# EAGLE schematic micromouse2018_v1 (EAGLE 9.0.1)
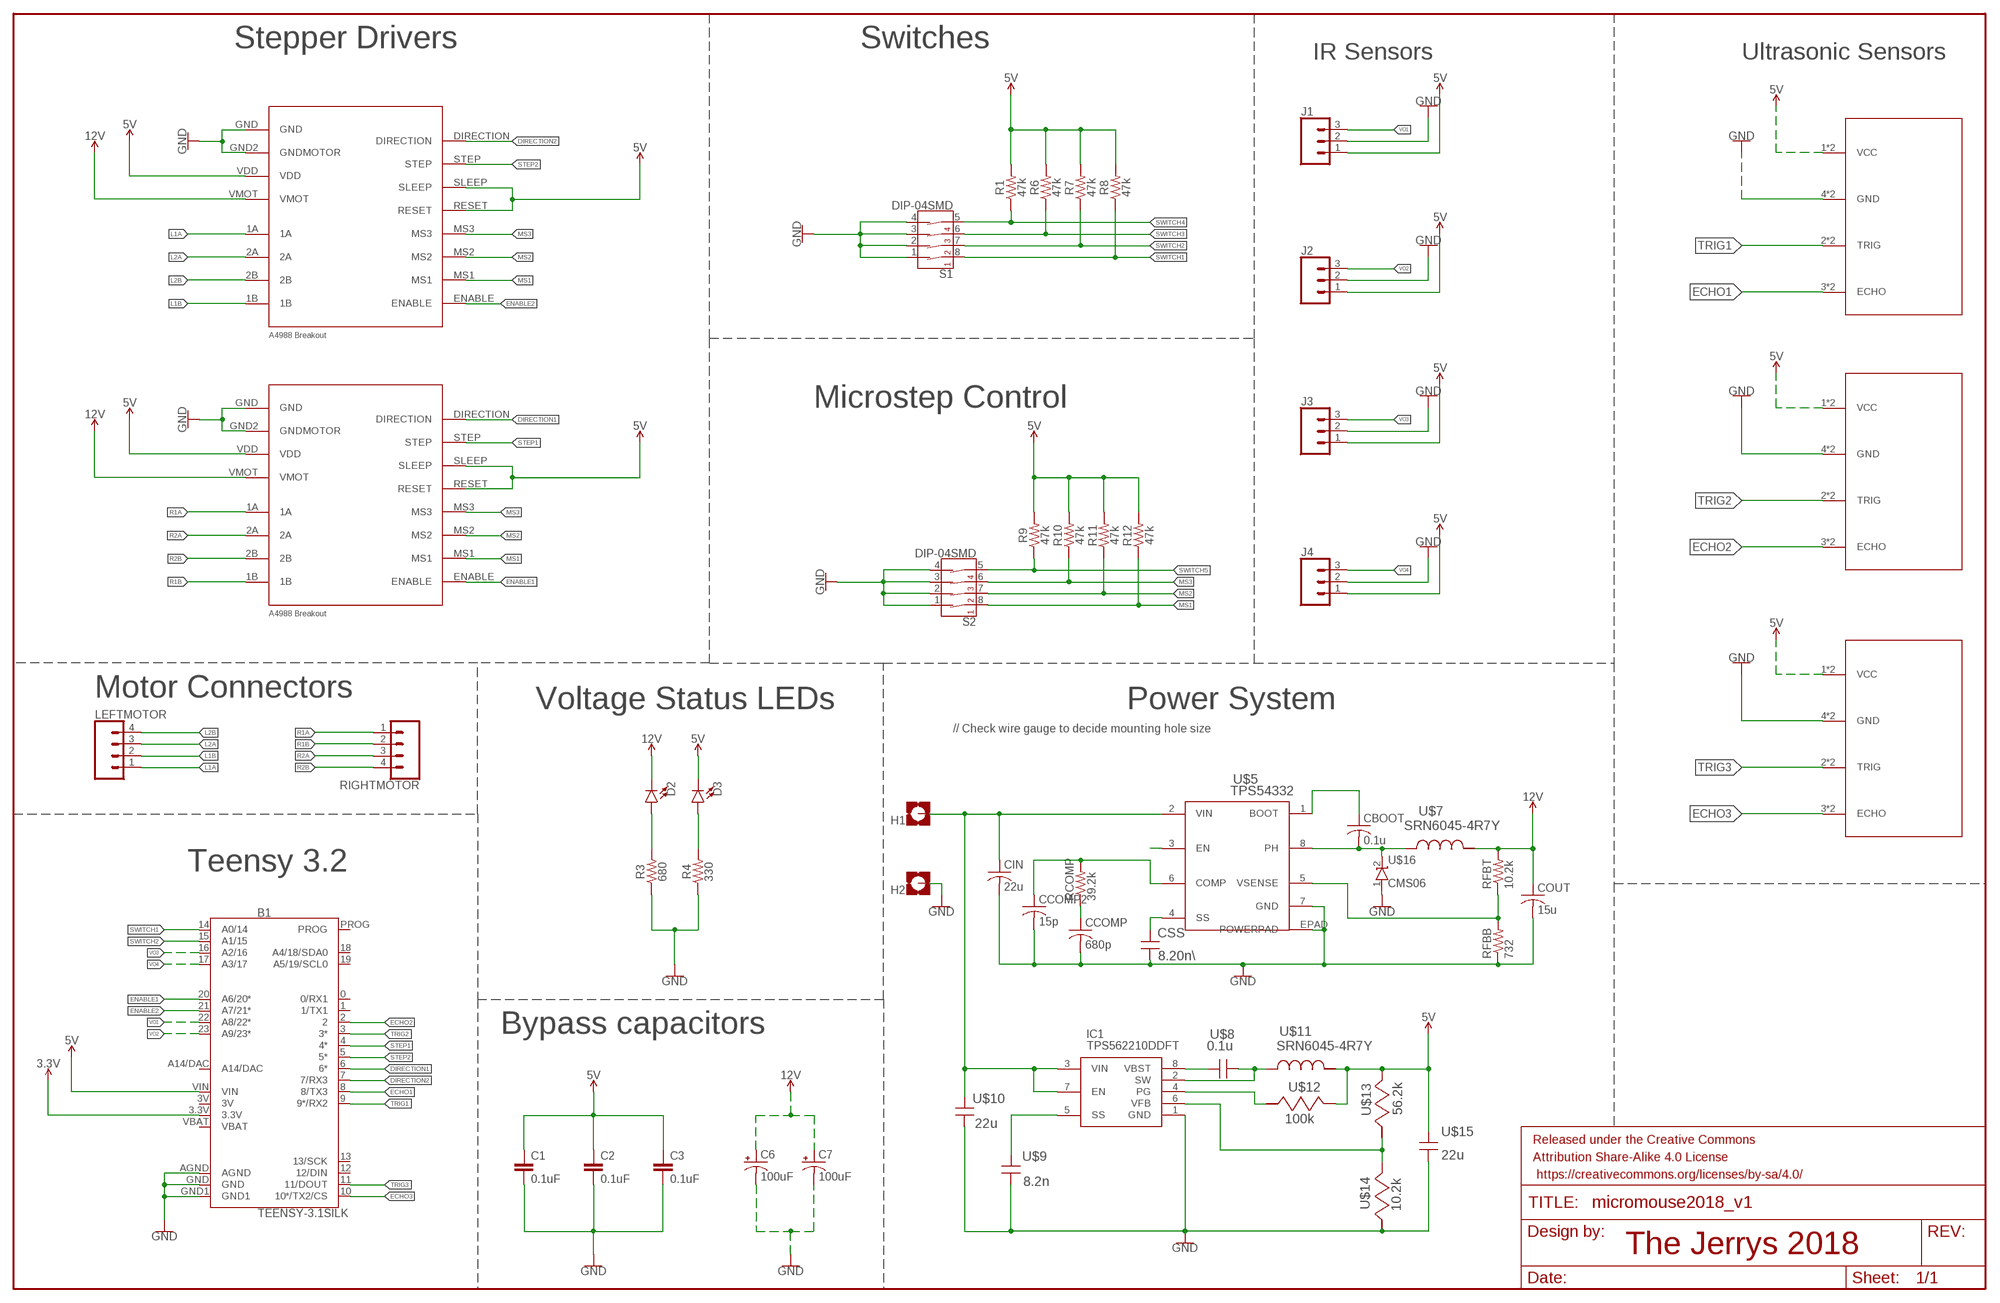
[diagram p0: schematic, sheet 1]

## Parts
B1  TEENSY-3.1SILK  [TEENSY-3.1]
C1  0.1uF  0.1UF-0603-25V-(+80/-20%)  [0603]
C2  0.1uF  0.1UF-0603-25V-(+80/-20%)  [0603]
C3  0.1uF  0.1UF-0603-25V-(+80/-20%)  [0603]
C6  100uF  100UF-POLAR-25V-20%(ELEC)  [PANASONIC_D]
C7  100uF  100UF-POLAR-25V-20%(ELEC)  [PANASONIC_D]
CBOOT  0.1u  C-USC0805  [C0805]
CCOMP  680p  C-USC0805  [C0805]
CCOMP2  15p  C-USC0805  [C0805]
CIN  22u  C-USC1210  [C1210]
COUT  15u  C-USC0805  [C0805]
CSS  8.20n\  12063A822JAT2A  [1206]
D2  LED0603  [LED-0603]
D3  LED0603  [LED-0603]
FRAME1  FRAME-LEDGER  [CREATIVE_COMMONS]
H1  MOUNT-PAD-SQUARE2.8  [2,8-PAD-SQUARE]
H2  MOUNT-PAD-SQUARE2.8  [2,8-PAD-SQUARE]
IC1  TPS562210DDFT  [SOT65P280X110-8N]
J1  CONN_03JST-PTH-VERT  [JST-3-PTH-VERT]
J2  CONN_03JST-PTH-VERT  [JST-3-PTH-VERT]
J3  CONN_03JST-PTH-VERT  [JST-3-PTH-VERT]
J4  CONN_03JST-PTH-VERT  [JST-3-PTH-VERT]
LEFTMOTOR  CONN_04LONGPADS  [1X04_LONGPADS]
R1  47k  47KOHM-0603-1/10W-1%  [0603]
R3  680  680OHM-0603-1/10W-5%  [0603]
R4  330  330OHM-0603-1/10W-1%  [0603]
R6  47k  47KOHM-0603-1/10W-1%  [0603]
R7  47k  47KOHM-0603-1/10W-1%  [0603]
R8  47k  47KOHM-0603-1/10W-1%  [0603]
R9  47k  47KOHM-0603-1/10W-1%  [0603]
R10  47k  47KOHM-0603-1/10W-1%  [0603]
R11  47k  47KOHM-0603-1/10W-1%  [0603]
R12  47k  47KOHM-0603-1/10W-1%  [0603]
RCOMP  39.2k  R-US_R0805  [R0805]
RFBB  732  R-US_R0805  [R0805]
RFBT  10.2k  R-US_R0805  [R0805]
RIGHTMOTOR  CONN_04LONGPADS  [1X04_LONGPADS]
S1  DIP-04SMD  [DIPSWITCH-04-SMD]
S2  DIP-04SMD  [DIPSWITCH-04-SMD]
U$1  A4988_BREAKOUT  [A4988_BREAKOUT]
U$2  A4988_BREAKOUT  [A4988_BREAKOUT]
U$3  ULTRASONIC  [1X04_SMD_VERTICAL_COMBO]
U$4  ULTRASONIC  [1X04_SMD_VERTICAL_COMBO]
U$5  TPS54332  [DDA8_2P13X3-M]
U$6  ULTRASONIC  [1X04_SMD_VERTICAL_COMBO]
U$7  SRN6045-4R7Y  [SRN6045]
U$8  0.1u  08053C104KAT2A  [0805]
U$9  8.2n  12063A822JAT2A  [1206]
U$10  22u  GRM32ER61E226KE15L  [1210]
U$11  SRN6045-4R7Y  [SRN6045]
U$12  100k  RR1220P-104-D  [0805]
U$13  56.2k  ERJ-6ENF5622V  [0805]
U$14  10.2k  ERJ-6ENF1022V  [0805]
U$15  22u  GRM31CR61A226KE19L  [1206_190]
U$16  CMS06  [SODFL4724X108N]

## Nets
3.3V: B1.3.3V
5V: B1.VIN C1.1 C2.1 C3.1 D3.C J1.1 J2.1 J3.1 J4.1 R1.2 R6.2 R7.2 R8.2 R9.2 R10.2 R11.2 R12.2 U$1.RESET U$1.SLEEP U$1.VDD U$2.RESET U$2.SLEEP U$2.VDD U$3.1(VCC) U$3.1-2(VCC) U$4.1(VCC) U$4.1-2(VCC) U$6.1(VCC) U$6.1-2(VCC) U$11.2 U$12.1 U$13.1 U$15.1
12V: C6.+ C7.+ COUT.1 D2.C RFBT.2 U$1.VMOT U$2.VMOT U$7.2
BOOT: IC1.2(SW) U$8.1 U$11.1
DIRECTION1: B1.6(6*) U$2.DIRECTION
DIRECTION2: B1.7(7/RX3) U$1.DIRECTION
ECHO1: B1.8(8/TX3) U$3.3(ECHO) U$3.3-2(ECHO)
ECHO2: B1.2 U$4.3(ECHO) U$4.3-2(ECHO)
ECHO3: B1.10(10*/TX2/CS) U$6.3(ECHO) U$6.3-2(ECHO)
ENABLE1: B1.20(A6/20*) U$2.ENABLE
ENABLE2: B1.21(A7/21*) U$1.ENABLE
GND: B1.AGND B1.GND B1.GND1 C1.2 C2.2 C3.2 C6.- C7.- CCOMP2.2 CCOMP.2 CIN.2 COUT.2 CSS.1 H2.B2,8(MOUNT) IC1.1(GND) J1.2 J2.2 J3.2 J4.2 R3.1 R4.1 RFBB.1 S1.1(1A) S1.2(2A) S1.3(3A) S1.4(4A) S2.1(1A) S2.2(2A) S2.3(3A) S2.4(4A) U$1.GND U$1.GND2(GNDMOTOR) U$2.GND U$2.GND2(GNDMOTOR) U$3.4(GND) U$3.4-2(GND) U$4.4(GND) U$4.4-2(GND) U$5.7(GND) U$5.EPAD(POWERPAD) U$6.4(GND) U$6.4-2(GND) U$9.2 U$10.2 U$14.2 U$15.2 U$16.1(A)
L1A: LEFTMOTOR.1 U$1.1A
L1B: LEFTMOTOR.2 U$1.1B
L2A: LEFTMOTOR.3 U$1.2A
L2B: LEFTMOTOR.4 U$1.2B
MS1: R12.1 S2.8(1B) U$1.MS1 U$2.MS1
MS2: R11.1 S2.7(2B) U$1.MS2 U$2.MS2
MS3: R10.1 S2.6(3B) U$1.MS3 U$2.MS3
N$1: D2.A R3.2
N$2: D3.A R4.2
N$5: CSS.2 U$5.4(SS)
N$6: IC1.8(VBST) U$8.2
N$8: U$5.3(EN)
N$9: RFBB.2 RFBT.1 U$5.5(VSENSE)
N$10: CBOOT.1 U$5.1(BOOT)
N$11: CCOMP2.1 RCOMP.2 U$5.6(COMP)
N$12: CCOMP.1 RCOMP.1
N$15: IC1.4(PG) U$12.2
N$16: IC1.6(VFB) U$13.2 U$14.1
N$18: IC1.5(SS) U$9.1
PH: CBOOT.2 U$5.8(PH) U$7.1 U$16.2(K)
R1A: RIGHTMOTOR.1 U$2.1A
R1B: RIGHTMOTOR.2 U$2.1B
R2A: RIGHTMOTOR.3 U$2.2A
R2B: RIGHTMOTOR.4 U$2.2B
STEP1: B1.4(4*) U$2.STEP
STEP2: B1.5(5*) U$1.STEP
SWITCH1: B1.14(A0/14) R8.1 S1.8(1B)
SWITCH2: B1.15(A1/15) R7.1 S1.7(2B)
SWITCH3: R6.1 S1.6(3B)
SWITCH4: R1.1 S1.5(4B)
SWITCH5: R9.1 S2.5(4B)
TRIG1: B1.9(9*/RX2) U$3.2(TRIG) U$3.2-2(TRIG)
TRIG2: B1.3(3*) U$4.2(TRIG) U$4.2-2(TRIG)
TRIG3: B1.11(11/DOUT) U$6.2(TRIG) U$6.2-2(TRIG)
VIN: CIN.1 H1.B2,8(MOUNT) IC1.3(VIN) IC1.7(EN) U$5.2(VIN) U$10.1
VO1: B1.22(A8/22*) J1.3
VO2: B1.23(A9/23*) J2.3
VO3: B1.16(A2/16) J3.3
VO4: B1.17(A3/17) J4.3
Unconnected: B1.0(0/RX1) B1.1(1/TX1) B1.12(12/DIN) B1.13(13/SCK) B1.18(A4/18/SDA0) B1.19(A5/19/SCL0) B1.A14/DAC B1.PROG

## Notes on the sheet
- Stepper Drivers | Switches
- IR Sensors | Ultrasonic Sensors
- Microstep Control
- Motor Connectors
- Voltage Status LEDs | Power System
- // Check wire gauge to decide mounting hole size
- Teensy 3.2
- Bypass capacitors
- The Jerrys 2018

## Power pins joined to a net without a drawn wire
3V: B1.3V
VBAT: B1.VBAT

## Library data of the parts
B1 = SparkFun-Boards:TEENSY-3.1: Teensy 3+ Footprint Mechanical footprint with connectors for Teensy Development Board with ARM Cortex. SparkFun Products: Teensy 3.2 <https://www.sparkfun.com/products/13736> Teensy LC <https://www.sparkfun.com/products/13305>; SF_ID: DEV-12646
C1-C3 = SparkFun-Capacitors:0.1UF: 0.1µF ceramic capacitors A capacitor is a passive two-terminal electrical component used to store electrical energy temporarily in an electric field.; PROD_ID: CAP-00810
C6 C7 = SparkFun-Capacitors:100UF-POLAR: 100µF polarized capacitors A capacitor is a passive two-terminal electrical component used to store electrical energy temporarily in an electric field.; PROD_ID: CAP-12547
CBOOT CCOMP CCOMP2 COUT = resistor:C-US: CAPACITOR, American symbol
CIN = rcl:C-US: CAPACITOR, American symbol
CSS U$9 = AcceleratedDesigns_Lib:12063A822JAT2A; CAP: 8.2E8; DATASHEETURL: httpwww.avx.comdocsCatalogsccog.pdf; ESR: 0.0; IRMS: 0.0; MANUFACTURER_NAME: AVX; MANUFACTURER_PART_NUMBER: 12063A822JAT2A; VDC: 25.0; VENDOR: AVX
D2 D3 = SparkFun-LED:LED: LED (Generic) Standard schematic elements and footprints for 5mm, 3mm, 1206, and 0603 sized LEDs. Generic LEDs with no color specified.
FRAME1 = SparkFun-Aesthetics:FRAME-LEDGER: Schematic Frame - Ledger Standard 11x14 US Ledger frame
H1 H2 = holes:MOUNT-PAD-SQUARE: MOUNTING PAD, square
IC1 = TPS562210DDFT:TPS562210DDFT: Step-down DC-DC Conv 4.5-17V 2A TSOT23-8 Texas Instruments, TPS562210DDFT Step-Down Switching Regulator 2A Adjustable, 0.76 7 V, 8-Pin SOT-23 Source: Datasheet <http://www.ti.com/lit/ds/symlink/tps562210.pdf>; DESCRIPTION: Step-down DC-DC Conv 4.5-17V 2A TSOT23-8 Texas Instruments, TPS562210DDFT Step-Down Switching Regulator 2A Adjustable, 0.76 7 V, 8-Pin SOT-23; HEIGHT: 1.1mm; MANUFACTURER_NAME: Texas Instruments; MANUFACTURER_PART_NUMBER: TPS562210DDFT; RS_PART_NUMBER: 9009845; RS_PRICE/STOCK: http://uk.rs-online.com/web/p/products/9009845
J1-J4 = SparkFun-Connectors:CONN_03: Multi connection point. Often used as Generic Header-pin footprint for 0.1 inch spaced/style header connections On any of the 0.1 inch spaced packages, you can populate with these: Break Away Headers - Straight <https://www.sparkfun.com/products/116> (PRT-00116) Break Away Male Headers - Right Angle <https://www.sparkfun.com/products/553> (PRT-00553) Female Headers <https://www.sparkfun.com/products/115> (PRT-00115) Break Away Headers - Machine Pin <https://www.sparkfun.com/products/117> (PRT-00117) Break Away Female Headers - Swiss Machine Pin <https://www.sparkfun.com/products/743> (PRT-00743) Stackable Header - 3 Pin (Female, 0.1") <https://www.sparkfun.com/products/13875> (PRT-13875) For SCREWTERMINALS and SPRING TERMINALS visit here: Screw Terimnals on SparkFun.com <https://www.sparkfun.com/search/results?term=Screw+Terminals> (5mm/3.5mm/2.54mm spacing) This device is also useful as a general connection point to wire up your design to another part of your project. Our various solder wires solder well into these plated through hole pads. Hook-Up Wire - Assortment (Stranded, 22 AWG) <https://www.sparkfun.com/products/11375> (PRT-11375) Hook-Up Wire - Assortment (Solid Core, 22 AWG) <https://www.sparkfun.com/products/11367> (PRT-11367) View the entire wire category on our website here <https://www.sparkfun.com/categories/141> Special notes: Molex polarized connector foot print use with SKU : PRT-08232 with associated crimp pins and housings.; PROD_ID: CONN-13230
LEFTMOTOR RIGHTMOTOR = SparkFun-Connectors:CONN_04: Multi connection point. Often used as Generic Header-pin footprint for 0.1 inch spaced/style header connections On any of the 0.1 inch spaced packages, you can populate with these: Break Away Headers - Straight <https://www.sparkfun.com/products/116> (PRT-00116) Break Away Male Headers - Right Angle <https://www.sparkfun.com/products/553> (PRT-00553) Female Headers <https://www.sparkfun.com/products/115> (PRT-00115) Break Away Headers - Machine Pin <https://www.sparkfun.com/products/117> (PRT-00117) Break Away Female Headers - Swiss Machine Pin <https://www.sparkfun.com/products/743> (PRT-00743) For SCREWTERMINALS and SPRING TERMINALS visit here: Screw Terimnals on SparkFun.com <https://www.sparkfun.com/search/results?term=Screw+Terminals> (5mm/3.5mm/2.54mm spacing) This device is also useful as a general connection point to wire up your design to another part of your project. Our various solder wires solder well into these plated through hole pads. Hook-Up Wire - Assortment (Stranded, 22 AWG) <https://www.sparkfun.com/products/11375> (PRT-11375) Hook-Up Wire - Assortment (Solid Core, 22 AWG) <https://www.sparkfun.com/products/11367> (PRT-11367) View the entire wire category on our website here <https://www.sparkfun.com/categories/141> Special notes: Molex polarized connector foot print use with SKU : PRT-08231 with associated crimp pins and housings. 1MM SMD Version SKU: PRT-10208; PROD_ID: CONN-09696
R1 R6-R12 = SparkFun-Resistors:47KOHM: 47kΩ resistor A resistor is a passive two-terminal electrical component that implements electrical resistance as a circuit element. Resistors act to reduce current flow, and, at the same time, act to lower voltage levels within circuits. - Wikipedia; PROD_ID: RES-07871
R3 = SparkFun-Resistors:680OHM: 680Ω resistor A resistor is a passive two-terminal electrical component that implements electrical resistance as a circuit element. Resistors act to reduce current flow, and, at the same time, act to lower voltage levels within circuits. - Wikipedia; PROD_ID: RES-09333
R4 = SparkFun-Resistors:330OHM: 330Ω resistor A resistor is a passive two-terminal electrical component that implements electrical resistance as a circuit element. Resistors act to reduce current flow, and, at the same time, act to lower voltage levels within circuits. - Wikipedia; PROD_ID: RES-00818
RCOMP RFBB RFBT = resistor:R-US_: RESISTOR, American symbol
S1 S2 = SparkFun-Switches:DIP-04: 4-Position DIP Switch 4-circuit DIP (dual inline package) switch. Commonly used to physcially set a circuit's behavior. SparkFun Products Prototype Part; PROD_ID: SWCH-12418
U$1 U$2 = raParts:A4988_BREAKOUT
U$3 U$4 U$6 = raParts:ULTRASONIC
U$5 = TPS54332:TPS54332
U$7 U$11 = AcceleratedDesigns_Lib:SRN6045-4R7Y; DATASHEETURL: httpwww.bourns.comdataglobalpdfsSRN6045.pdf; DCR: 0.0376; IDC: 3.0; L: 4.7E6; MANUFACTURER_NAME: Bourns; MANUFACTURER_PART_NUMBER: SRN60454R7Y; VENDOR: Bourns
U$8 = AcceleratedDesigns_Lib:08053C104KAT2A; CAP: 1.0E7; ESR: 0.28; IRMS: 0.0; MANUFACTURER_NAME: AVX; MANUFACTURER_PART_NUMBER: 08053C104KAT2A; VDC: 25.0; VENDOR: AVX
U$10 = AcceleratedDesigns_Lib:GRM32ER61E226KE15L; CAP: 2.2E5; ESR: 0.0020; IRMS: 0.0; MANUFACTURER_NAME: MuRata; MANUFACTURER_PART_NUMBER: GRM32ER61E226KE15L; VDC: 25.0; VENDOR: MuRata
U$12 = AcceleratedDesigns_Lib:RR1220P-104-D; MANUFACTURER_NAME: Susumu Co Ltd; MANUFACTURER_PART_NUMBER: RR1220P104D; POWER: 0.1; RESISTANCE: 100000.0; TOLERANCE: 0.5; VENDOR: Susumu Co Ltd
U$13 = AcceleratedDesigns_Lib:ERJ-6ENF5622V; MANUFACTURER_NAME: Panasonic; MANUFACTURER_PART_NUMBER: ERJ6ENF5622V; POWER: 0.125; RESISTANCE: 56200.0; TOLERANCE: 1.0; VENDOR: Panasonic
U$14 = AcceleratedDesigns_Lib:ERJ-6ENF1022V; MANUFACTURER_NAME: Panasonic; MANUFACTURER_PART_NUMBER: ERJ6ENF1022V; POWER: 0.125; RESISTANCE: 10200.0; TOLERANCE: 1.0; VENDOR: Panasonic
U$15 = AcceleratedDesigns_Lib:GRM31CR61A226KE19L; CAP: 2.2E5; ESR: 0.0; IRMS: 0.0; MANUFACTURER_NAME: MuRata; MANUFACTURER_PART_NUMBER: GRM31CR61A226KE19L; VDC: 10.0; VENDOR: MuRata
U$16 = Scraps:CMS06